# EAGLE design schematic (EAGLE 9.6.2)
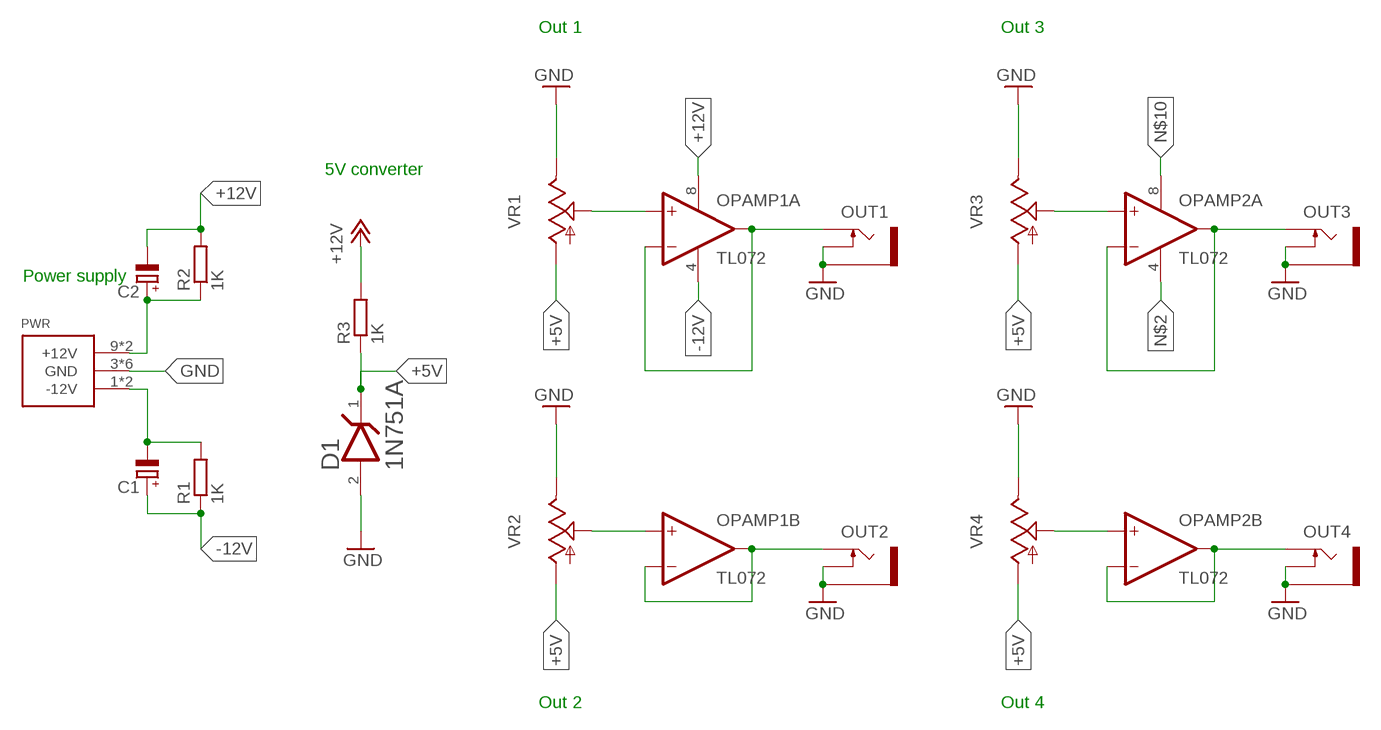
[diagram p0: schematic, sheet 1]

## Parts
C1  CPOL-EUE2.5-5V  [E2,5-4R]
C2  CPOL-EUE2.5-5V  [E2,5-4R]
D1  ON_SEMI_1N751AON_SEMI_1N751A_0_0  [ON_SEMI_1N751A_0]
OPAMP1  TL072  [DIL08-SML]
OPAMP2  TL072  [DIL08-SML]
OUT1  THONKICONNNEW  [WQP-PJ301M-12_JACK]
OUT2  THONKICONNNEW  [WQP-PJ301M-12_JACK]
OUT3  THONKICONNNEW  [WQP-PJ301M-12_JACK]
OUT4  THONKICONNNEW  [WQP-PJ301M-12_JACK]
PWR  POWER_SIMPLE10  [POWER_10]
R1  1K  R-EU_0204/5  [0204/5]
R2  1K  R-EU_0204/5  [0204/5]
R3  1K  R-EU_0204/5  [0204/5]
VR1  9MM_SNAP-IN_POT_  [9MM_SNAP-IN_POT]
VR2  9MM_SNAP-IN_POT_  [9MM_SNAP-IN_POT]
VR3  9MM_SNAP-IN_POT_  [9MM_SNAP-IN_POT]
VR4  9MM_SNAP-IN_POT_  [9MM_SNAP-IN_POT]

## Nets
+5V: D1.1(CATHODE) R3.1 VR1.1(A) VR2.1(A) VR3.1(A) VR4.1(A)
+12V: C2.+ OPAMP1.8(P:V+) PWR.9(+12V) PWR.10(+12V) R2.1 R3.2
-12V: C1.- OPAMP1.4(P:V-) PWR.1(-12V) PWR.2(-12V) R1.2
GND: D1.2(ANODE) OUT1.P$2_SWITCH(SWITCH) OUT1.P$3_SLEEVE(SLEEVE) OUT2.P$2_SWITCH(SWITCH) OUT2.P$3_SLEEVE(SLEEVE) OUT3.P$2_SWITCH(SWITCH) OUT3.P$3_SLEEVE(SLEEVE) OUT4.P$2_SWITCH(SWITCH) OUT4.P$3_SLEEVE(SLEEVE) PWR.3(GND) PWR.4(GND) PWR.5(GND) PWR.6(GND) PWR.7(GND) PWR.8(GND) VR1.3(E) VR2.3(E) VR3.3(E) VR4.3(E)
N$1: OPAMP1.3(A:+IN) VR1.2(S)
N$2: OPAMP2.4(P:V-)
N$3: OPAMP1.6(B:-IN) OPAMP1.7(B:OUT) OUT2.P$1_TIP(TIP)
N$4: OPAMP1.5(B:+IN) VR2.2(S)
N$5: OPAMP2.1(A:OUT) OPAMP2.2(A:-IN) OUT3.P$1_TIP(TIP)
N$6: OPAMP2.3(A:+IN) VR3.2(S)
N$7: OPAMP2.6(B:-IN) OPAMP2.7(B:OUT) OUT4.P$1_TIP(TIP)
N$8: OPAMP2.5(B:+IN) VR4.2(S)
N$9: OPAMP1.1(A:OUT) OPAMP1.2(A:-IN) OUT1.P$1_TIP(TIP)
N$10: OPAMP2.8(P:V+)
N$11: C1.+ R1.1
N$12: C2.- R2.2

## Notes on the sheet
- Out 1 | Out 3
- 5V converter
- Power supply
- Out 2 | Out 4

## Library data of the parts
C1 C2 = rcl:CPOL-EU: POLARIZED CAPACITOR, European symbol; SPICEPREFIX: C
D1 = ON Semi - 1N751A:ON_SEMI_1N751A: DIODE ZENER 5.1V 500MW DO35; CENTROID_NOT_SPECIFIED: No; DATASHEET: https://media.digikey.com/pdf/Data%20Sheets/Fairchild%20PDFs/1N746A-759A,4370A-4372A.pdf; DIGIKEY_DESCRIPTION: DIODE ZENER 5.1V 500MW DO35; DIGIKEY_PART_NUMBER: 1N751A-ND; IPC_LAND_PATTERN_NAME: DIOAD744W75L432D191; LEAD_FREE: yes; MF: ON Semi; MFG_PACKAGE_IDENT: DO35; MOUSER_DESCRIPTION: Zener Diodes 5.1V 0.5W Zener; MOUSER_PART_NUMBER: 512-1N751A; MPN: 1N751A; OC_NEWARK: 13T8945; PACKAGE: AXIAL; PREFIX: D; ROHS: yes; TEMPERATURE_RANGE_HIGH: +200°C; TEMPERATURE_RANGE_LOW: -65°C
OPAMP1 OPAMP2 = MusicThingModular:TL072: Generic Dual Op Amp
OUT1-OUT4 = MusicThingModular:THONKICONN: 3.5mm socket for Eurorack modular synths
PWR = eurorack:POWER_SIMPLE
R1-R3 = rcl:R-EU_: RESISTOR, European symbol; MF: VISHAY; MPN: CCF551K00FKE36; OC_NEWARK: 71M1025; SPICEPREFIX: R
VR1-VR4 = MusicThingModular:9MM_SNAP-IN_POT: 9mm vertical snap-in pot, Alpha / Panasonic style; OC_NEWARK: unknown

## Module JHG
Ports: 

### Library data of the parts

## Net classes
0 default: width 0.305 mm, drill 0.508 mm, clearance 0.254 mm

## Board
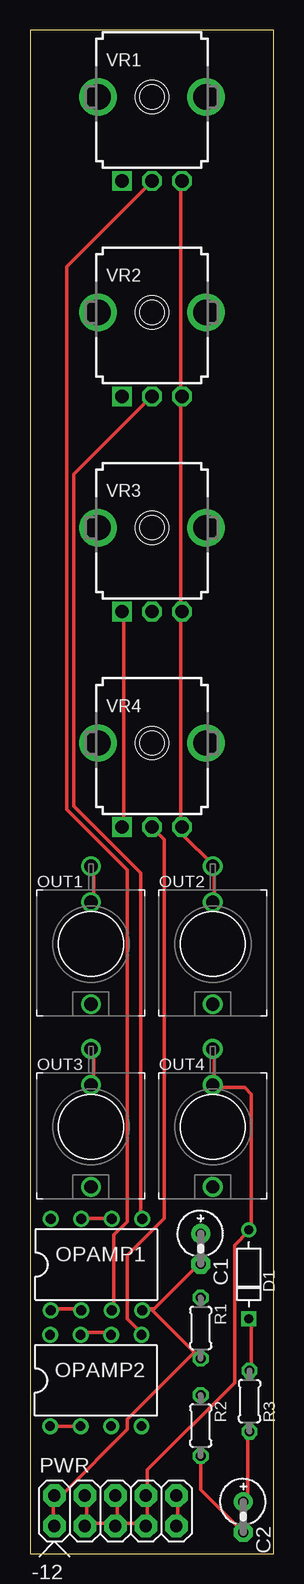
[diagram p1: board, top side]
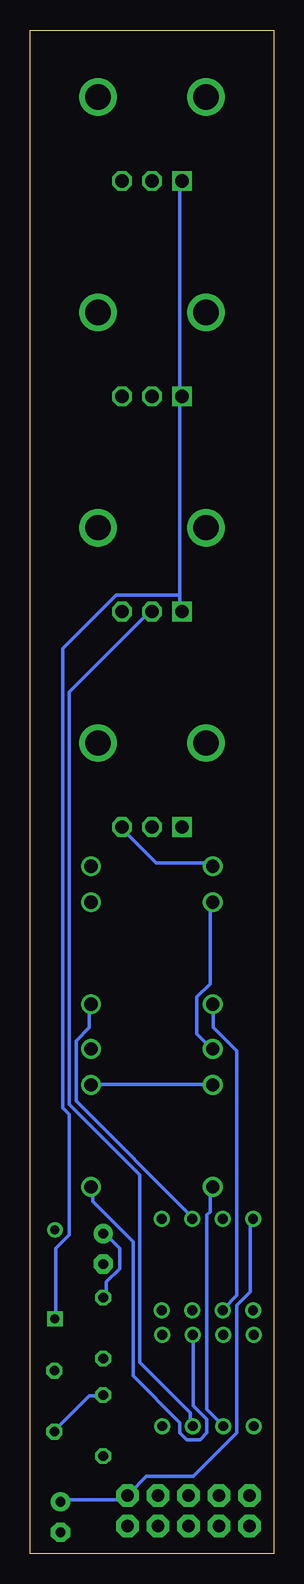
[diagram p2: board, bottom side, seen from below]

Size 20.32 x 127 mm. Coordinates in mm from the lower left corner, seen from the top.
Outline: 0,0 20.32,0 20.32,127 0,127 0,0
Copper layers (1*16): Top 0.035mm / dielectric 1.5mm / Bottom 0.035mm
Design rules "default": minimum track width 6mil, minimum drill 0.35mm, track to track 6mil, track to pad 6mil, pad to pad 6mil, via to via 6mil, smd to smd 6mil, copper to edge 40mil, drill to drill 6mil, minimum pad ring 10mil, minimum via ring 8mil, stop-mask expansion 4mil, vias tented up to drill 0mil, thermal gap 10mil

### Footprints (pad centres in the part's own frame; a part is rotated, then mirrored left to right if it is on the bottom)
E2,5-4R = drill 0.813 pad 1.6: + -1.27,0 | drill 0.813 pad 1.6 octagon: - 1.27,0
ON_SEMI_1N751A_0 = drill 0.75 pad 1.25 square: 1 -3.72,0 | drill 0.75 pad 1.25: 2 3.72,0
DIL08-SML = drill 0.813 pad 1.27: 1 -3.81,-3.81; 2 -1.27,-3.81; 3 1.27,-3.81; 4 3.81,-3.81; 5 3.81,3.81; 6 1.27,3.81; 7 -1.27,3.81; 8 -3.81,3.81
WQP-PJ301M-12_JACK = drill 1.1: P$1_TIP 0,5; P$2_SWITCH 0,-3.5; P$3_SLEEVE 0,-6.5
POWER_10 = drill 1.016 pad 1.88 octagon: 1 -5.08,-1.27; 2 -5.08,1.27; 3 -2.54,-1.27; 4 -2.54,1.27; 5 0,-1.27; 6 0,1.27; 7 2.54,-1.27; 8 2.54,1.27; 9 5.08,-1.27; 10 5.08,1.27
0204/5 = drill 0.813 octagon: 1 -2.54,0; 2 2.54,0
9MM_SNAP-IN_POT = drill 1.1 square: 1 -2.5,-7 | drill 1.1 octagon: 2 0,-7; 3 2.5,-7 | drill 2.1 pad 2.794: CHASSIS1 -4.5,0; CHASSIS2 4.5,0

### Placement (x,y rotation side)
C1  14.22,25.4 270 top
C2  17.78,3.05 270 top
D1  18.24,23.27 90 top
OPAMP1  5.54,24.08 0 top
OPAMP2  5.49,14.43 0 top
OUT1  5.08,50.8 180 top
OUT2  15.24,50.8 180 top
OUT3  5.08,35.56 180 top
OUT4  15.24,35.56 180 top
PWR  7.11,3.56 0 top
R1  14.22,18.8 270 top
R2  14.22,10.67 270 top
R3  18.29,12.7 270 top
VR1  10.16,121.41 0 top
VR2  10.16,103.46 0 top
VR3  10.16,85.51 0 top
VR4  10.16,67.56 0 top

### Tracks (layer width: path | path; a pad name or v marks a point on that pad's centre or on a via)
+5V
  Top 0.305: D1.1 18.44,19.28 18.44,15.37 R3.1 | VR4.1 7.82,60.63 7.82,78.51 VR3.1
  Bottom 0.305: 7.82,79.91 7.82,78.79 VR3.1 | 7.82,79.91 7.82,96.39 VR2.1 7.82,96.67 7.82,114.28 VR1.1 | 7.82,79.91 13.13,79.91 17.6,75.44 17.6,37.16 17.04,36.6 17.04,26.54 18.16,25.43 18.16,19.56 D1.1
+12V
  Top 0.305: PWR.9 12.29,2.52 12.29,4.75 PWR.10 | R3.2 18.16,10.06 18.16,4.75 17.88,4.47 C2.+
  Bottom 0.305: R2.1 14.25,13.13 15.37,13.13 18.16,10.34 R3.2 | OPAMP1.8 1.96,27.66 1.96,21.79 3.07,20.68 3.07,10.06 6.71,6.43 10.62,6.43 12.01,5.03 PWR.10 12.29,4.75 12.57,4.47 17.6,4.47 C2.+
-12V
  Top 0.305: PWR.1 1.96,2.52 1.96,4.75 PWR.2 2.23,5.03 2.79,5.03 8.1,10.34 8.1,11.18 13.69,16.76 | 10.06,20.4 10.34,20.4 13.97,24.03 C1.- | 10.06,20.4 9.5,20.4 OPAMP1.4 | 10.06,20.4 13.69,16.76 | 13.69,16.76 13.97,16.48 R1.2
GND
  Top 0.305: VR1.3 12.57,114.28 12.57,96.67 VR2.3 12.57,96.39 12.57,78.79 VR3.3 12.57,78.51 12.57,60.63 VR4.3 12.85,60.35 12.85,59.79 15.09,57.56 OUT2.P$3_SLEEVE 15.37,57.28 15.37,54.48 OUT2.P$2_SWITCH | OUT1.P$2_SWITCH 5.31,54.48 5.31,57.28 OUT1.P$3_SLEEVE | 4.75,2.52 4.75,4.75 PWR.4 | 7.26,2.52 7.26,4.75 PWR.6 | 4.75,2.52 6.99,2.52 PWR.5 7.26,2.52 | 4.75,2.52 PWR.3 | 7.26,2.52 9.5,2.52 PWR.7 9.78,2.52 9.78,4.75 PWR.8 9.78,5.03 9.78,6.99 17.04,14.25 17.04,25.7 18.16,26.82 D1.2 18.44,27.1 18.44,38.28 17.88,38.84 15.37,38.84 OUT4.P$2_SWITCH 15.37,39.12 15.37,41.91 OUT4.P$3_SLEEVE | OUT3.P$2_SWITCH 5.31,39.12 5.31,41.91 OUT3.P$3_SLEEVE
  Bottom 0.305: OUT1.P$3_SLEEVE 5.31,57.56 9.78,57.56 12.57,60.35 VR4.3 | OUT3.P$2_SWITCH 5.31,39.12 15.09,39.12 OUT4.P$2_SWITCH | OUT1.P$2_SWITCH 5.31,54.2 5.31,47.5 6.43,46.38 6.43,43.31 5.31,42.19 OUT3.P$3_SLEEVE
N$1
  Top 0.305: OPAMP1.3 6.99,20.4 6.99,26.54 8.1,27.66 8.1,57 3.07,62.03 3.07,107.29 10.06,114.28 VR1.2
N$3
  Top 0.305: OPAMP1.7 4.47,27.94 6.71,27.94 OPAMP1.6
  Bottom 0.305: OUT2.P$1_TIP 15.37,45.54 15.37,43.87 16.48,42.75 16.48,37.72 6.71,27.94 OPAMP1.6
N$4
  Top 0.305: OPAMP1.5 9.22,27.94 9.22,56.72 3.63,62.31 3.63,89.97 10.06,96.39 VR2.2
N$5
  Top 0.305: OPAMP2.2 OPAMP2.1
  Bottom 0.305: OUT3.P$1_TIP 5.31,30.45 5.31,28.5 5.59,28.22 5.59,12.01 4.19,10.62 OPAMP2.2
N$6
  Bottom 0.305: OPAMP2.3 6.99,10.62 6.99,11.73 11.18,15.93 11.18,31.57 17.04,37.44 17.04,71.81 10.34,78.51 VR3.2
N$7
  Top 0.305: OPAMP2.7 4.47,18.44 6.71,18.44 OPAMP2.6
  Bottom 0.305: OUT4.P$1_TIP 15.09,30.45 15.09,29.34 11.73,25.98 11.73,14.81 7.82,10.9 7.82,10.06 7.26,9.5 6.15,9.5 5.59,10.06 5.59,11.18 6.71,12.29 6.71,18.16 OPAMP2.6
N$8
  Top 0.305: OPAMP2.5 9.22,18.44 8.1,19.56 8.1,24.87 11.18,27.94 11.18,59.51 10.34,60.35 VR4.2
N$9
  Top 0.305: OPAMP1.1 1.96,20.4 4.19,20.4 OPAMP1.2
  Bottom 0.305: OUT1.P$1_TIP 5.03,45.54 5.03,43.87 3.07,41.91 3.07,21.51 4.19,20.4 OPAMP1.2
N$11
  Bottom 0.305: R1.1 13.97,21.51 13.97,22.63 12.85,23.75 12.85,25.43 13.97,26.54 C1.+
N$12
  Top 0.305: C2.- 14.25,5.31 14.25,8.1 R2.2